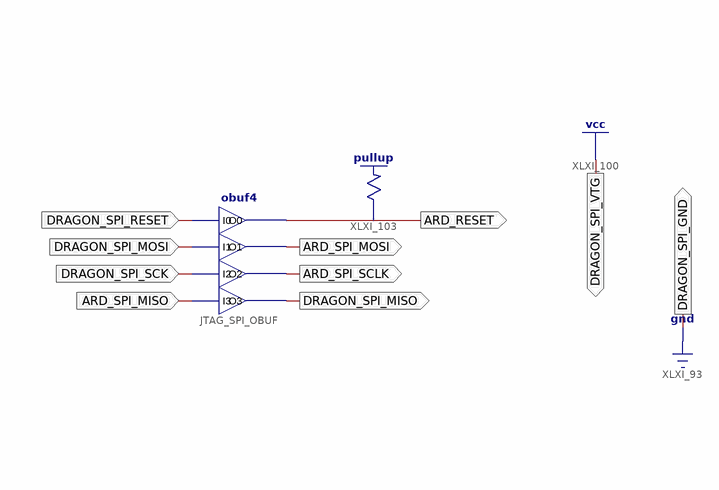
[diagram p0: schematic sheet 1]
// Xilinx ISE schematic Papilio_DUO_LX9.sch (spartan6) as structural Verilog: 2 symbols, 10 ports
module Papilio_DUO_LX9 (
  input  DRAGON_SPI_MOSI,
  input  DRAGON_SPI_SCK,
  input  ARD_SPI_MISO,
  input  DRAGON_SPI_RESET,
  output DRAGON_SPI_GND,
  output DRAGON_SPI_VTG,
  output ARD_SPI_MOSI,
  output ARD_SPI_SCLK,
  output DRAGON_SPI_MISO,
  output ARD_RESET
);

  obuf4 JTAG_SPI_OBUF (
    .I0(DRAGON_SPI_RESET), .I1(DRAGON_SPI_MOSI), .I2(DRAGON_SPI_SCK), .I3(ARD_SPI_MISO), .O0(ARD_RESET),
    .O1(ARD_SPI_MOSI), .O2(ARD_SPI_SCLK), .O3(DRAGON_SPI_MISO));
  \pullup  XLXI_103 (.O(ARD_RESET));

  assign DRAGON_SPI_GND = 1'b0;
  assign DRAGON_SPI_VTG = 1'b1;
endmodule
